# Altium schematic sheet MicrochipUWB.SchDoc
size A4; SheetNumber: 4; SheetTotal: 6
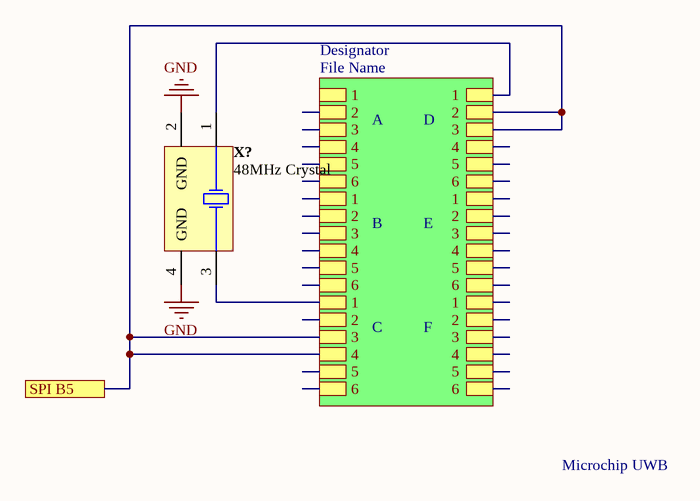
[diagram p0: MicrochipUWB.SchDoc]

## Parts
X?  48MHz Crystal  [ABRA-ABM3B-4_V]

## Sub-sheets
Designator = File Name: 4, 5, 6, 1, 2, 3, 4, 5, 6, 1, 2, 3, 4, 5, 6, 1, 2, 3, 4, 5, 6, 1, 2, 3, 4, 5, 6, 1, 2, 3, 4, 5, 6, 1, 2, 3

## Ports
SPI B5

## Nets
GND: X?.2(GND) X?.4(GND)
SPI B5: port SPI B5, sheet Designator/3, sheet Designator/4, sheet Designator/2, sheet Designator/3
NetX?_1: X?.1(X1) ; sheet Designator/1
NetX?_3: X?.3(X2) ; sheet Designator/1

## Notes on the sheet
- A
- D
- B
- E
- C
- F
- Microchip UWB

## Library data of the parts
X? = CMP-003-00019-2: Ceramic SMD Crystal, 24 MHz, +/- 20 ppm, 18 pF, -20 to 70 degC, 4-Pin SMD, RoHS, Tape and Reel; Manufacturer: Abracon; Load Capacitance: 18pF; Frequency Tolerance: 20ppm; ESR: 50; Resistance: 50Ohm; Frequency: 24MHz; Package Quantity: 1000; Packaging: TapeandReel; RoHS Compliant: True; Package Description: 4-Pin Surface Mount Device, Body 5 x 3.2 mm; Mounting Technology: SM; Pins: 4; Datasheet URL: http://www.abracon.com/Resonators/abm3b.pdf; Tolerance: 20ppm; Manufacturer URL: http://www.abracon.com/; Max Operating Temperature: 70°C; Datasheet Version: Aug-15; Min Operating Temperature: -20°C; Package Reference: ABM3B; Case/Package: CSMD